# Altium schematic sheet customphone.SchDoc
size A4
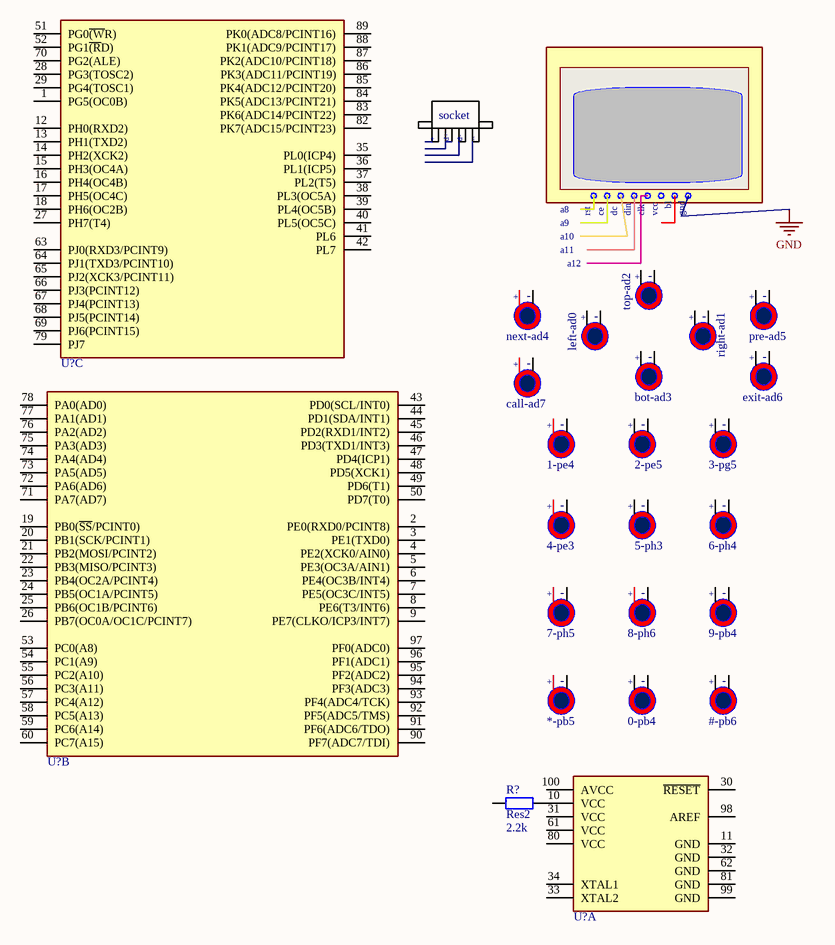
[diagram p0: customphone.SchDoc]

## Parts
(Parts that share a designator on the sheet are numbered #1, #2 ... from top to bottom, then left to right.)
R?  Res2  value 2.2k  [AXIAL-0.4]
U?#1  ATMEGA2560-16AU  (value not drawn)  (part C of 3)
U?#2  ATMEGA2560-16AU  (value not drawn)  (part B of 3)
U?#3  ATMEGA2560-16AU  (value not drawn)  (part A of 3)

## Nets
NetR?_2: R?.2 U?#3.10(VCC)

Not connected (* = marked no-connect by the designer): R? 1; U?#1 1(PG5(OC0B)) 12(PH0(RXD2)) 13(PH1(TXD2)) 14(PH2(XCK2)) 15(PH3(OC4A)) 16(PH4(OC4B)) 17(PH5(OC4C)) 18(PH6(OC2B)) 27(PH7(T4)) 28(PG3(TOSC2)) 29(PG4(TOSC1)) 35(PL0(ICP4)) 36(PL1(ICP5)) 37(PL2(T5)) 38(PL3(OC5A)) 39(PL4(OC5B)) 40(PL5(OC5C)) 41(PL6) 42(PL7) 51(PG0~{(W}R)) 52(PG1~{(R}D)) 63(PJ0(RXD3/PCINT9)) 64(PJ1(TXD3/PCINT10)) 65(PJ2(XCK3/PCINT11)) 66(PJ3(PCINT12)) 67(PJ4(PCINT13)) 68(PJ5(PCINT14)) 69(PJ6(PCINT15)) 70(PG2(ALE)) 79(PJ7) 82(PK7(ADC15/PCINT23)) 83(PK6(ADC14/PCINT22)) 84(PK5(ADC13/PCINT21)) 85(PK4(ADC12/PCINT20)) 86(PK3(ADC11/PCINT19)) 87(PK2(ADC10/PCINT18)) 88(PK1(ADC9/PCINT17)) 89(PK0(ADC8/PCINT16)); U?#2 2(PE0(RXD0/PCINT8)) 3(PE1(TXD0)) 4(PE2(XCK0/AIN0)) 5(PE3(OC3A/AIN1)) 6(PE4(OC3B/INT4)) 7(PE5(OC3C/INT5)) 8(PE6(T3/INT6)) 9(PE7(CLKO/ICP3/INT7)) 19(PB0(~{SS}/PCINT0)) 20(PB1(SCK/PCINT1)) 21(PB2(MOSI/PCINT2)) 22(PB3(MISO/PCINT3)) 23(PB4(OC2A/PCINT4)) 24(PB5(OC1A/PCINT5)) 25(PB6(OC1B/PCINT6)) 26(PB7(OC0A/OC1C/PCINT7)) 43(PD0(SCL/INT0)) 44(PD1(SDA/INT1)) 45(PD2(RXD1/INT2)) 46(PD3(TXD1/INT3)) 47(PD4(ICP1)) 48(PD5(XCK1)) 49(PD6(T1)) 50(PD7(T0)) 53(PC0(A8)) 54(PC1(A9)) 55(PC2(A10)) 56(PC3(A11)) 57(PC4(A12)) 58(PC5(A13)) 59(PC6(A14)) 60(PC7(A15)) 71(PA7(AD7)) 72(PA6(AD6)) 73(PA5(AD5)) 74(PA4(AD4)) 75(PA3(AD3)) 76(PA2(AD2)) 77(PA1(AD1)) 78(PA0(AD0)) 90(PF7(ADC7/TDI)) 91(PF6(ADC6/TDO)) 92(PF5(ADC5/TMS)) 93(PF4(ADC4/TCK)) 94(PF3(ADC3)) 95(PF2(ADC2)) 96(PF1(ADC1)) 97(PF0(ADC0)); U?#3 11(GND) 30(~{RESET}) 31(VCC) 32(GND) 33(XTAL2) 34(XTAL1) 61(VCC) 62(GND) 80(VCC) 81(GND) 98(AREF) 99(GND) 100(AVCC)

## Notes on the sheet
- socket
- +
- d+
- d-
- --
- bl
- a9
- a10
- a11
- a8
- a12
- rst
- ce
- dc
- din
- clk
- vcc
- gnd
- next-ad4
- -
- top-ad2
- pre-ad5
- left-ad0
- bot-ad3
- right-ad1
- exit-ad6
- call-ad7
- 1-pe4
- 2-pe5
- 3-pg5
- 4-pe3
- 5-ph3
- 6-ph4
- 7-ph5
- 8-ph6
- 9-pb4
- *-pb5
- 0-pb4
- #-pb6

## Library data of the parts
R? = Res2: Resistor; Published: 8-Jun-2000; LatestRevisionDate: 17-Jul-2002; LatestRevisionNote: Re-released for DXP Platform.; PackageReference: AXIAL-0.4; Publisher: Altium Limited; PackageDescription: Axial Device, Thru-Hole; 2 Leads; 0.4 in Pin Spacing